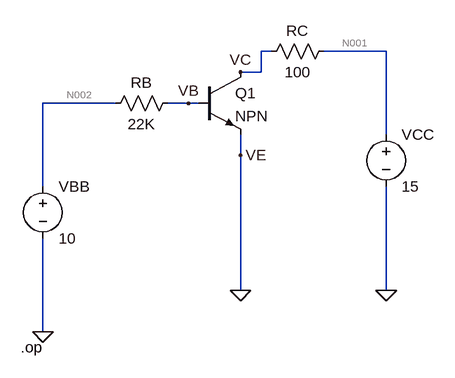
[diagram p0: schematic Draft1.asc]
Draft1.asc, the LTspice schematic file:
Version 4
SHEET 1 880 680
WIRE 416 -64 400 -64
WIRE 592 -64 496 -64
WIRE 400 -32 400 -64
WIRE 400 -32 368 -32
WIRE 176 16 64 16
WIRE 288 16 256 16
WIRE 304 16 288 16
WIRE 592 64 592 -64
WIRE 368 96 368 64
WIRE 64 144 64 16
WIRE 368 304 368 96
WIRE 592 304 592 144
WIRE 64 368 64 224
FLAG 592 304 0
FLAG 368 304 0
FLAG 64 368 0
FLAG 368 96 VE
FLAG 288 16 VB
FLAG 368 -32 VC
SYMBOL voltage 64 128 R0
WINDOW 123 0 0 Left 2
WINDOW 39 0 0 Left 2
SYMATTR InstName VBB
SYMATTR Value 10
SYMBOL voltage 592 48 R0
WINDOW 123 0 0 Left 2
WINDOW 39 0 0 Left 2
SYMATTR InstName VCC
SYMATTR Value 15
SYMBOL res 272 0 R90
WINDOW 0 0 56 VBottom 2
WINDOW 3 32 56 VTop 2
SYMATTR InstName RB
SYMATTR Value 22K
SYMBOL res 512 -80 R90
WINDOW 0 0 56 VBottom 2
WINDOW 3 32 56 VTop 2
SYMATTR InstName RC
SYMATTR Value 100
SYMBOL npn 304 -32 R0
SYMATTR InstName Q1
TEXT 30 392 Left 2 !.op

The netlist it stands for:
* Draft1.asc
VBB N002 0 10
VCC N001 0 15
RB VB N002 22K
RC N001 VC 100
Q1 VC VB 0 0 NPN
.model NPN NPN
.model PNP PNP
.lib standard.bjt
.op
.backanno
.end

* Results of the author's LTspice run, read from the files saved beside the schematic
* Operating Point:
*   V(n002) = 10 V
*   V(n001) = 15 V
*   V(vb) = 870.6 mV
*   V(vc) = 10.85 V
*   Ic(Q1) = 41.5 mA
*   Ib(Q1) = 415 µA
*   Ie(Q1) = -41.91 mA
*   I(Rc) = 41.5 mA
*   I(Rb) = -415 µA
*   I(Vcc) = -41.5 mA
*   I(Vbb) = -415 µA
* From the log:
*   Semiconductor Device Operating Points:
*                           --- Bipolar Transistors ---
*   Name:       q1
*   Model:      npn
*   Ib:       4.15e-04
*   Ic:       4.15e-02
*   Vbe:      8.71e-01
*   Vbc:     -9.98e+00
*   Vce:      1.09e+01
*   BetaDC:   1.00e+02
*   Gm:       1.60e+00
*   Rpi:      6.23e+01
*   Rx:       0.00e+00
*   Ro:         NaN
*   Cbe:      0.00e+00
*   Cbc:      0.00e+00
*   Cjs:      0.00e+00
*   BetaAC:   1.00e+02
*   Cbx:      0.00e+00
*   Ft:       0.00e+00